# Altium schematic sheet Sheet2.SchDoc
size A; SheetNumber: 2; SheetTotal: 2
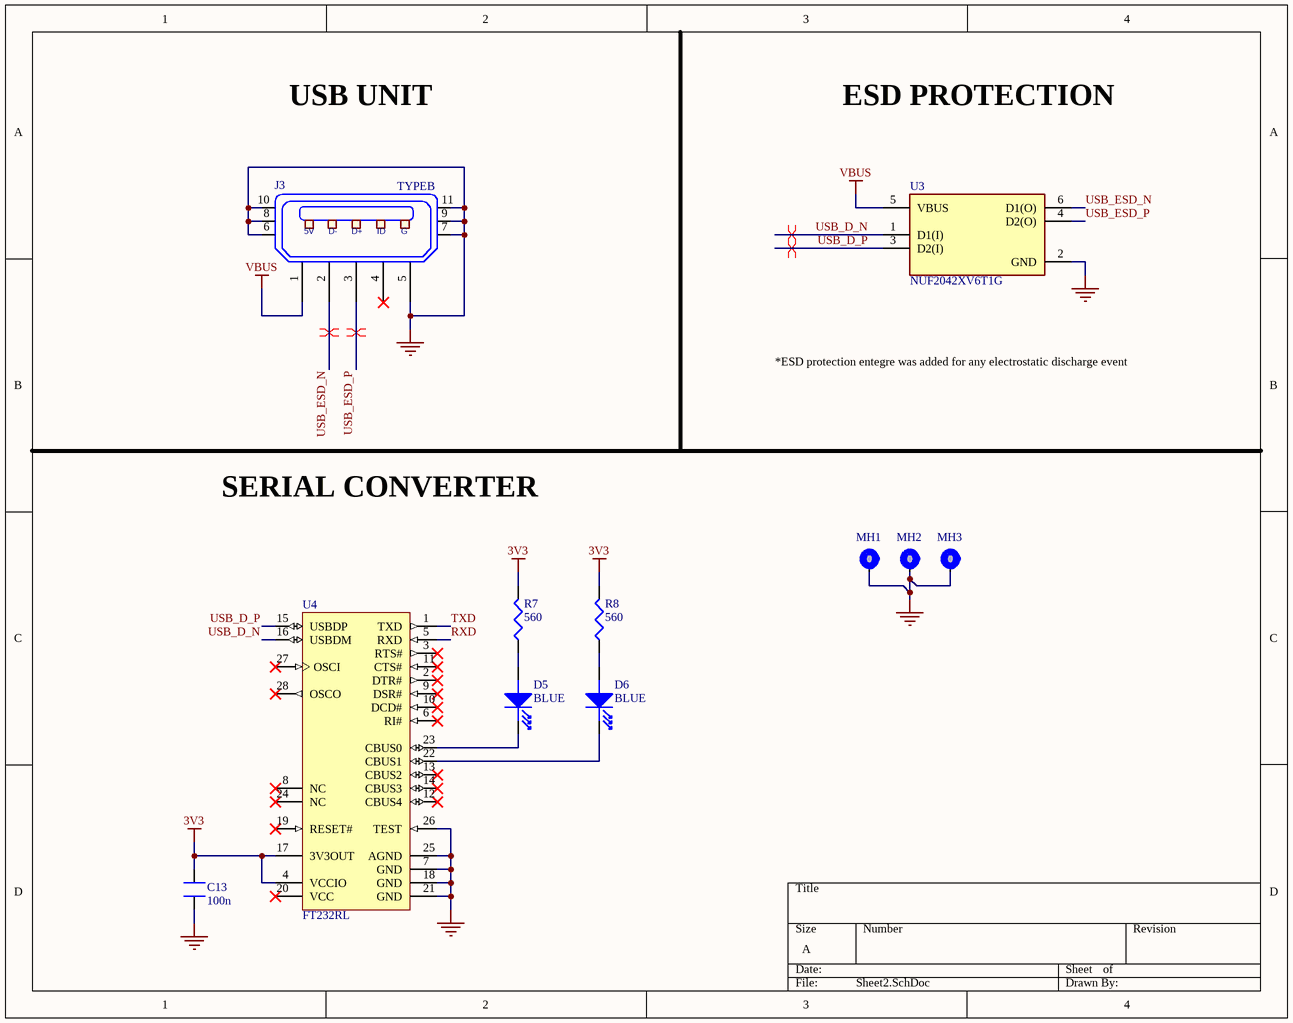
[diagram p0: Sheet2.SchDoc]

## Parts
C13  100n  [Z0603]
D5  BLUE  [LED-0603]
D6  BLUE  [LED-0603]
J3  TYPEB  [USB-A]
MH1  MH_7.4MMC_3.2MMD  [MH_7.4MMC_3.2MMD_NON_COPPER_NPLT]  (value not drawn)  (no BOM)
MH2  MH_7.4MMC_3.2MMD  [MH_7.4MMC_3.2MMD_NON_COPPER_NPLT]  (value not drawn)  (no BOM)
MH3  MH_7.4MMC_3.2MMD  [MH_7.4MMC_3.2MMD_NON_COPPER_NPLT]  (value not drawn)  (no BOM)
R7  560  [R0603]
R8  560  [R0603]
U3  NUF2042XV6T1G  [FP-463A-MFG]
U4  FT232RL  [FTDI-SSOP-28_M]

## Nets
3V3: C13.2 R7.2 R8.2 U4.4(VCCIO) U4.17(3V3OUT)
GND: C13.1 J3.5 J3.6 J3.7 J3.8 J3.9 J3.10 J3.11 MH1.1 MH2.1 MH3.1 U3.2(GND) U4.7(GND) U4.18(GND) U4.21(GND) U4.25(AGND) U4.26(TEST)
VBUS: J3.1 U3.5(VBUS)
RXD: U4.5(RXD)
TXD: U4.1(TXD)
USB_D_N: U3.1(D1(I)) U4.16(USBDM)
USB_D_P: U3.3(D2(I)) U4.15(USBDP)
USB_ESD_N: J3.2 U3.6(D1(O))
USB_ESD_P: J3.3 U3.4(D2(O))
NetD5_1: D5.1(Cathode) U4.23(CBUS0)
NetD5_2: D5.2(Anode) R7.1
NetD6_1: D6.1(Cathode) U4.22(CBUS1)
NetD6_2: D6.2(Anode) R8.1

Not connected (* = marked no-connect by the designer): J3 4*; U4 2(DTR#)* 3(RTS#)* 6(RI#)* 8(NC)* 9(DSR#)* 10(DCD#)* 11(CTS#)* 12(CBUS4)* 13(CBUS2)* 14(CBUS3)* 19(RESET#)* 20(VCC)* 24(NC)* 27(OSCI)* 28(OSCO)*

## Layout directives
differential pair; differential pair class DIFF_ESD: USB_ESD_N, USB_ESD_P
differential pair; differential pair class DIFF_USB: USB_D_N, USB_D_P

## Notes on the sheet
- USB UNIT
- ESD PROTECTION
- *ESD protection entegre was added for any electrostatic discharge event
- SERIAL CONVERTER
- (in symbol USB-TYPEB) 5V; D-; D+; ID; G

## Library data of the parts
C13 = C0603: Manufacturer Product Number: C0603C104J5RAC7867; Unit_Price: 0,38; Case/Package: 0603; Order Link: https://ozdisan.com/pasif-komponentler/kondansatorler/smt-smd-ve-mlcc-kondansatorler/C0603C104J5RAC7867
D5 D6 = L0603: Manufacturer Product Number: 27-21/B7C-ZR1S1N/3C; Unit_Price: 2,28; Case/Package: 0603; Order Link: https://ozdisan.com/led-ve-aydinlatma-cozumleri/led-komponentler/sinyal-ledler-renkli/27-21B7C-ZR1S1N3C
J3 = USB-TYPEB: Case/Package: TYPEB; Unit_Price: *; Order Link: *; Manufacturer Product Number: *
MH1-MH3 = MH_7.4MMNC_3.2MMD: Mounting Hole 7.4 mm Diameter (Non Copper), 3.2 mm Drill NPTH
R7 R8 = R0603: Manufacturer Product Number: 0603SAJ0561T5E; Order Link: https://ozdisan.com/pasif-komponentler/direncler/smt-smd-ve-cip-direncler/0603SAJ0561T5E; Unit Price: 0,03; Case/Package: 0603
U3 = CMP-1066-00027-2: FILTER RC(PI) 22 OHM/42PF SMD; Unit_Price: 5,87; Case/Package: SOT563; Order Link: https://ozdisan.com/entegre-devreler-ics/filtreler/emi-rfi-filtre-entegreleri/NUF2042XV6T1G; Manufacturer Product Number: NUF2042XV6T1G
U4 = CMP-2000-05029-1: IC USB FS SERIAL UART 28-SSOP; Manufacturer Product Number: FT232RL-REEL; Unit_Price: 136,56; Order Link: https://ozdisan.com/entegre-devreler-ics/interface-entegreleri/arayuz-kontrolor-entegreleri/FT232RL-REEL; Case/Package: SSOP28